# EAGLE design tx (EAGLE 6.5.0)
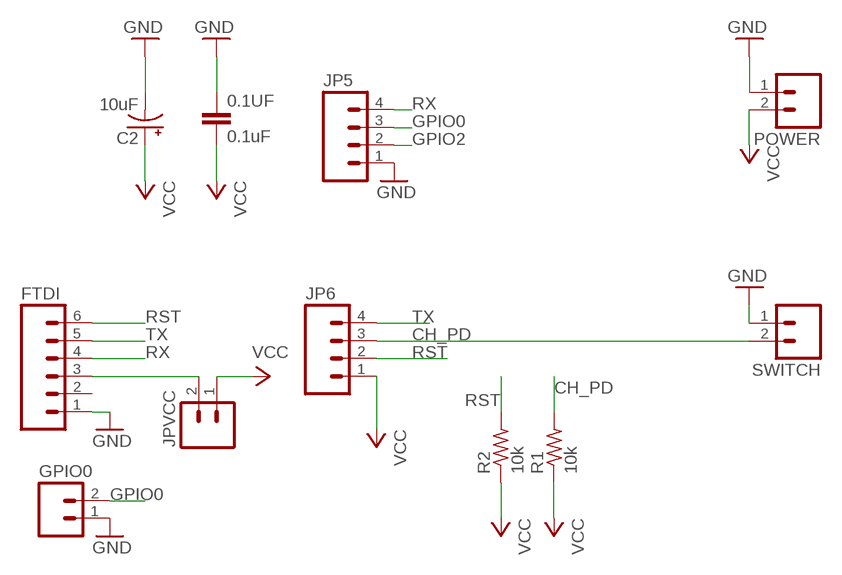
[diagram p0: schematic, sheet 1]

## Parts
0.1UF  0.1uF  0.1UF-100V-10%(0603)  [0603-CAP]
C2  10uF  CAP_POL6032  [EIA6032]
FTDI  M06LOCK  [1X06_LOCK]
GPIO0  M02PTH  [1X02]
JP5  M041X04_NO_SILK  [1X04_NO_SILK]
JP6  M041X04_NO_SILK  [1X04_NO_SILK]
JPVCC  M02PTH  [1X02]
POWER  M02PTH  [1X02]
R1  10k  R-US_R0805  [R0805]
R2  10k  R-US_R0805  [R0805]
SWITCH  M02PTH  [1X02]

## Nets
CH_PD: JP6.3 R1.2 SWITCH.2
GND: 0.1UF.1 C2.P$2(-) FTDI.1 GPIO0.1 JP5.1 POWER.1 SWITCH.1
GPIO0: GPIO0.2 JP5.3
GPIO2: JP5.2
N$1: FTDI.3 JPVCC.2
RST: FTDI.6 JP6.2 R2.2
RX: FTDI.4 JP5.4
TX: FTDI.5 JP6.4
VCC: 0.1UF.2 C2.P$1(+) JP6.1 JPVCC.1 POWER.2 R1.1 R2.1
Unconnected: FTDI.2

## Library data of the parts
0.1UF = SparkFun-Capacitors:0.1UF-100V-10%(0603): CAP-08390; PROD_ID: CAP-08390
C2 = SparkFun-Capacitors:CAP_POL: Capacitor Polarized These are standard SMD and PTH capacitors. Normally 10uF, 47uF, and 100uF in electrolytic and tantalum varieties. Always verify the external diameter of the through hole cap, it varies with capacity, voltage, and manufacturer. The EIA devices should be standard.
FTDI = SparkFun-Connectors:M06: Header 6 Standard 6-pin 0.1" header. Use with straight break away headers (SKU : PRT-00116), right angle break away headers (PRT-00553), swiss pins (PRT-00743), machine pins (PRT-00117), and female headers (PRT-00115). Molex polarized connector foot print use with SKU : PRT-08094 with associated crimp pins and housings. NOTES ON THE VARIANTS LOCK and LOCK_LONGPADS... This footprint was designed to help hold the alignment of a through-hole component (i.e. 6-pin header) while soldering it into place. You may notice that each hole has been shifted either up or down by 0.005 of an inch from it's more standard position (which is a perfectly straight line). This slight alteration caused the pins (the squares in the middle) to touch the edges of the holes. Because they are alternating, it causes a "brace" to hold the component in place. 0.005 has proven to be the perfect amount of "off-center" position when using our standard breakaway headers. Although looks a little odd when you look at the bare footprint, once you have a header in there, the alteration is very hard to notice. Also,if you push a header all the way into place, it is covered up entirely on the bottom side. This idea of altering the position of holes to aid alignment will be further integrated into the Sparkfun Library for other footprints. It can help hold any component with 3 or more connection pins.
GPIO0 JPVCC POWER SWITCH = SparkFun-Connectors:M02: Standard 2-pin 0.1" header. Use with - straight break away headers ( PRT-00116) - right angle break away headers (PRT-00553) - swiss pins (PRT-00743) - machine pins (PRT-00117) - female headers (PRT-00115) Molex polarized connector foot print use with: PRT-08233 with associated crimp pins and housings. 2.54_SCREWTERM for use with PRT-10571. 3.5mm Screw Terminal footprints for PRT-08084 5mm Screw Terminal footprints for use with PRT-08432
JP5 JP6 = SparkFun-Connectors:M04: Header 4 Standard 4-pin 0.1" header. Use with straight break away headers (SKU : PRT-00116), right angle break away headers (PRT-00553), swiss pins (PRT-00743), machine pins (PRT-00117), and female headers (PRT-00115). Molex polarized connector foot print use with SKU : PRT-08231 with associated crimp pins and housings. 1MM SMD Version SKU: PRT-10208
R1 R2 = adafruit:R-US_: RESISTOR, American symbol

## Board
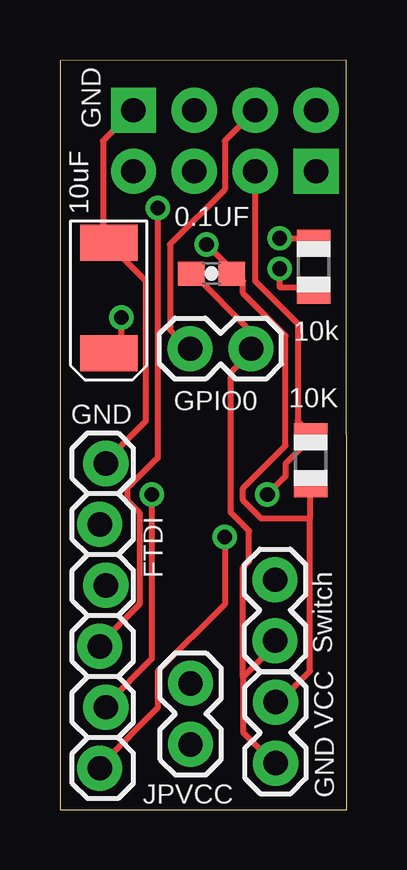
[diagram p1: board, top side]
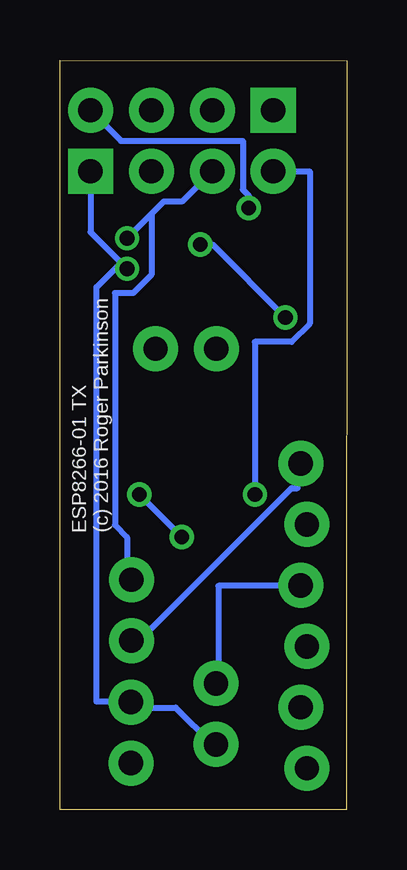
[diagram p2: board, bottom side, seen from below]

Size 11.96 x 31.24 mm. Coordinates in mm from the lower left corner, seen from the top.
Outline: 0,0 11.96,0 11.94,31.24 0,31.21 0,0
Copper layers (1*16): Top 0.035mm / dielectric 1.5mm / Bottom 0.035mm
Design rules "default": minimum track width 10mil, minimum drill 24mil, track to track 8mil, track to pad 8mil, pad to pad 8mil, via to via 8mil, smd to smd 8mil, copper to edge 40mil, drill to drill 8mil, minimum pad ring 10mil, minimum via ring 8mil, stop-mask expansion 4mil, vias tented up to drill 0mil, thermal gap 10mil

### Footprints (pad centres in the part's own frame; a part is rotated, then mirrored left to right if it is on the bottom)
0603-CAP = smd 1.1 x 1: 1 -0.85,0; 2 0.85,0
EIA6032 = smd 1.5 x 2.4: P$1 -2.3,0; P$2 2.3,0
1X06_LOCK = drill 1.016 pad 1.88: 1 0,0; 2 2.54,-0.254; 3 5.08,0; 4 7.62,-0.254; 5 10.16,0; 6 12.7,-0.254
1X02 = drill 1.016 pad 1.88: 1 0,0; 2 2.54,0
1X04_NO_SILK = drill 1.016 pad 1.88 square: 1 0,0 | drill 1.016 pad 1.88: 2 2.54,0; 3 5.08,0; 4 7.62,0
R0805 = smd 1.1 x 1.4: 1 -1,0; 2 1,0

### Placement (x,y rotation side)
0.1UF  6.32,22.34 0 top
C2  2.03,21.32 90 top
FTDI  1.92,14.43 270 top
GPIO0  7.97,19.21 180 top
JP5  3.07,29.14 0 top
JP6  10.69,26.6 180 top
JPVCC  5.45,2.73 90 top
POWER  9,1.94 90 top
R1  10.58,22.62 90 top
R2  10.46,14.56 90 top
SWITCH  8.98,7.04 90 top

### Tracks (layer width: path | path; a pad name or v marks a point on that pad's centre or on a via)
CH_PD  (via drill 0.61)
  Top 0.254: v9.16,23.81 10.43,23.81 R1.2
  Bottom 0.254: 8.15,24.83 7.64,25.33 6.88,25.33 JP6.3 | 8.15,24.83 v9.16,23.81 | 8.15,24.83 8.15,22.29 8.91,21.52 9.67,21.52 9.67,11.87 9.16,11.36 9.16,9.59 SWITCH.2
GND
  Top 0.254: JP5.1 1.8,27.87 1.8,23.81 C2.P$2 2.05,23.56 3.57,22.03 3.57,16.19 2.05,14.67 FTDI.1 | 0.1UF.1 5.61,22.29 7.89,20 7.89,19.24 GPIO0.1 7.89,18.98 7.13,18.22 7.13,12.38 7.89,11.62 7.89,10.35 7.64,10.09 7.64,5.52 | 7.64,5.52 7.64,3.24 8.91,1.97 POWER.1 | 7.64,5.52 8.91,6.79 SWITCH.1
  Bottom 0.254: FTDI.1 2.05,14.41 2.05,13.4 2.3,13.4 8.65,7.05 8.91,7.05 SWITCH.1
GPIO0
  Top 0.254: JP5.3 6.88,27.87 6.88,25.84 4.59,23.56 4.59,20 5.35,19.24 GPIO0.2
N$1
  Bottom 0.254: JPVCC.2 5.35,5.27 5.35,9.33 2.05,9.33 FTDI.3
RST  (via drill 0.61)
  Top 0.254: JP6.2 8.15,22.03 9.92,20.25 9.92,16.19 10.43,15.68 R2.2 10.43,15.43 9.42,14.41 9.42,13.9 v8.65,13.14 | v6.88,11.36 6.88,8.57 4.08,5.78 4.08,4.25 1.8,1.97 FTDI.6
  Bottom 0.254: v8.65,13.14 v6.88,11.36
RX  (via drill 0.61)
  Top 0.254: v4.08,25.08 4.08,14.67 2.81,13.4 2.81,12.89 3.32,12.38 3.32,8.57 1.8,7.05 FTDI.4
  Bottom 0.254: v4.08,25.08 4.08,25.59 4.34,25.84 4.34,27.87 9.42,27.87 JP5.4
TX  (via drill 0.61)
  Top 0.254: v3.83,13.14 3.83,6.28 2.05,4.51 FTDI.5
  Bottom 0.254: v3.83,13.14 3.83,19.49 2.3,19.49 1.54,20.25 1.54,26.6 JP6.4
VCC  (via drill 0.61)
  Top 0.254: 10.43,12.13 8.4,12.13 7.64,12.89 7.64,13.4 9.42,15.17 9.42,19.75 7.64,21.52 7.64,22.03 7.38,22.29 0.1UF.2 7.13,22.54 v6.11,23.56 | 10.43,12.13 10.43,13.4 R2.1 | v2.56,20.51 2.56,19.75 2.05,19.24 C2.P$1 | v9.16,22.54 9.16,21.78 10.43,21.78 R1.1 | 10.43,12.13 10.43,5.78 9.16,4.51 POWER.2
  Bottom 0.254: v2.56,20.51 5.61,23.56 v6.11,23.56 | 9.42,22.79 10.69,24.06 JP6.1 | JPVCC.1 5.61,2.73 7.13,4.25 8.91,4.25 POWER.2 9.16,4.51 10.43,4.51 10.43,21.78 9.42,22.79 | 9.42,22.79 v9.16,22.54

### Text on the board
tPlace: GND | 10uF | 10K | GND | Switch | VCC | GND
_bsilk: ESP8266-01 TX / (c) 2016 Roger Parkinson